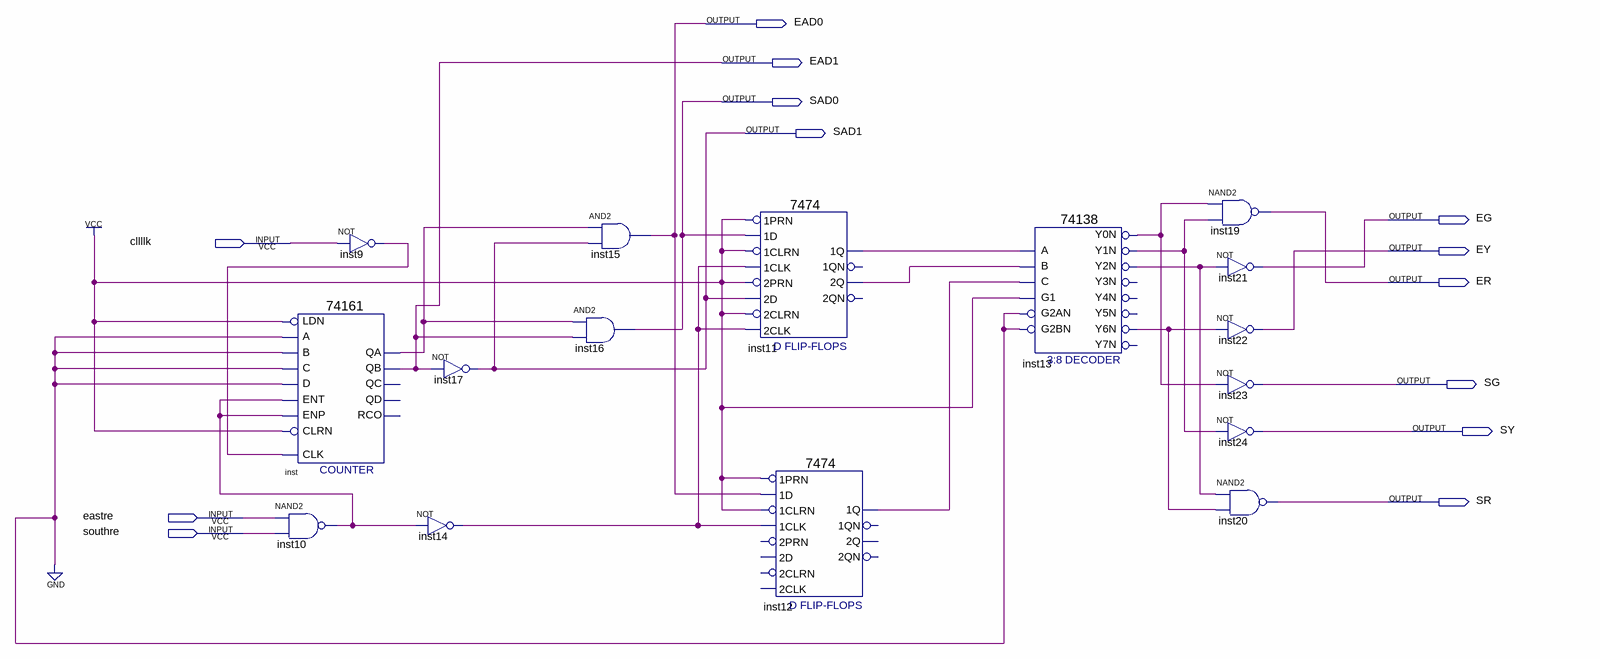
[diagram p0: schematic sheet]
// Quartus schematic count4.bdf as structural Verilog: 16 symbols, 13 pins
module count4 (
  input  cllllk,
  input  eastre,
  input  southre,
  output EAD0,
  output EAD1,
  output SAD0,
  output SAD1,
  output EG,
  output EY,
  output ER,
  output SG,
  output SY,
  output SR
);

  wire inst9_out, inst10_out, inst11_1q, inst11_2q, inst12_1q, inst13_y0n, inst13_y1n, inst13_y2n,
       inst13_y6n, inst14_out, inst_qa;

  \74161  inst (
    .CLRN(1'b1), .CLK(inst9_out), .ENP(inst10_out), .LDN(1'b1), .A(1'b0), .D(1'b0), .ENT(inst10_out),
    .B(1'b0), .C(1'b0), .QB(EAD1), .QA(inst_qa));  // open: QD, QC, RCO
  nand inst10 (inst10_out, eastre, southre);
  not inst9 (inst9_out, cllllk);
  not inst17 (SAD1, EAD1);
  not inst14 (inst14_out, inst10_out);
  and inst16 (SAD0, inst_qa, EAD1);
  and inst15 (EAD0, inst_qa, SAD1);
  \7474  inst11 (
    .\2D (SAD1), .\2PRN (1'b1), .\1CLK (inst14_out), .\1D (SAD0), .\1PRN (1'b1), .\2CLK (inst14_out),
    .\2CLRN (1'b1), .\1CLRN (1'b1), .\2Q (inst11_2q), .\1Q (inst11_1q));  // open: 1QN, 2QN
  \7474  inst12 (
    .\1CLK (inst14_out), .\1D (EAD0), .\1PRN (1'b1), .\1CLRN (1'b1), .\1Q (inst12_1q));  // open: 2D, 2PRN, 2CLK, 2CLRN, 1QN, 2Q, 2QN
  \74138  inst13 (
    .A(inst11_1q), .B(inst11_2q), .G1(1'b1), .C(inst12_1q), .G2AN(1'b0), .G2BN(1'b0), .Y0N(inst13_y0n),
    .Y1N(inst13_y1n), .Y2N(inst13_y2n), .Y6N(inst13_y6n));  // open: Y3N, Y4N, Y5N, Y7N
  nand inst19 (ER, inst13_y0n, inst13_y1n);
  not inst21 (EG, inst13_y2n);
  not inst22 (EY, inst13_y6n);
  not inst23 (SG, inst13_y0n);
  not inst24 (SY, inst13_y1n);
  nand inst20 (SR, inst13_y2n, inst13_y6n);
endmodule
